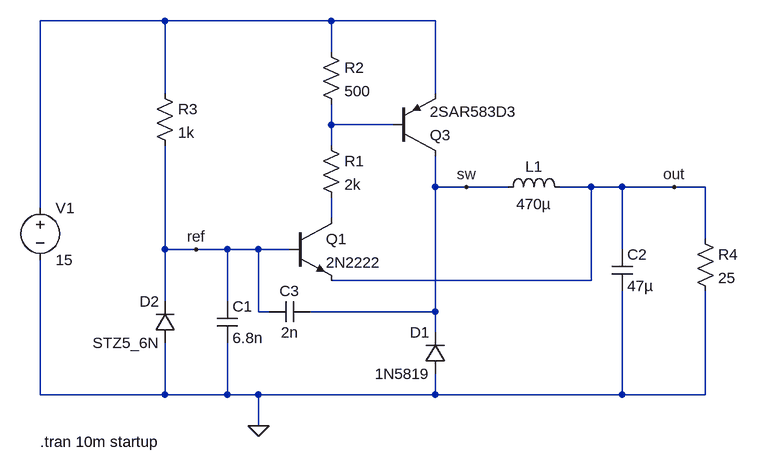
[diagram p0: schematic 2t_buck1.asc]
2t_buck1.asc, the LTspice schematic file:
Version 4.1
SHEET 1 880 680
WIRE -176 -240 -368 -240
WIRE 80 -240 -176 -240
WIRE 240 -240 80 -240
WIRE 80 -192 80 -240
WIRE -176 -128 -176 -240
WIRE 240 -128 240 -240
WIRE 80 -80 80 -112
WIRE 176 -80 80 -80
WIRE 80 -48 80 -80
WIRE 240 16 240 -32
WIRE 288 16 240 16
WIRE 352 16 288 16
WIRE 480 16 432 16
WIRE 528 16 480 16
WIRE 608 16 528 16
WIRE 656 16 608 16
WIRE -368 48 -368 -240
WIRE 80 64 80 32
WIRE 656 96 656 16
WIRE -176 112 -176 -48
WIRE -128 112 -176 112
WIRE -80 112 -128 112
WIRE -32 112 -80 112
WIRE 16 112 -32 112
WIRE 528 112 528 16
WIRE 480 160 480 16
WIRE 480 160 80 160
WIRE -176 192 -176 112
WIRE -80 192 -80 112
WIRE -32 208 -32 112
WIRE -16 208 -32 208
WIRE 240 208 240 16
WIRE 240 208 48 208
WIRE 240 240 240 208
WIRE -368 336 -368 128
WIRE -176 336 -176 256
WIRE -176 336 -368 336
WIRE -80 336 -80 256
WIRE -80 336 -176 336
WIRE -32 336 -80 336
WIRE 240 336 240 304
WIRE 240 336 -32 336
WIRE 528 336 528 176
WIRE 528 336 240 336
WIRE 656 336 656 176
WIRE 656 336 528 336
WIRE -32 384 -32 336
FLAG -32 384 0
FLAG 608 16 out
FLAG 288 16 sw
FLAG -128 112 ref
SYMBOL diode 256 304 R180
WINDOW 0 24 64 Left 2
WINDOW 3 24 0 Left 2
SYMATTR InstName D1
SYMATTR Value 1N5819
SYMATTR Description Diode
SYMATTR Type diode
SYMBOL npn 16 64 R0
SYMATTR InstName Q1
SYMATTR Value 2N2222
SYMBOL pnp 176 -32 M180
SYMATTR InstName Q3
SYMATTR Value 2SAR583D3
SYMBOL res 64 -64 R0
SYMATTR InstName R1
SYMATTR Value 2k
SYMBOL res 64 -208 R0
SYMATTR InstName R2
SYMATTR Value 500
SYMBOL res -192 -144 R0
SYMATTR InstName R3
SYMATTR Value 1k
SYMBOL cap -96 192 R0
SYMATTR InstName C1
SYMATTR Value 6.8n
SYMBOL cap 512 112 R0
SYMATTR InstName C2
SYMATTR Value 47µ
SYMBOL ind 336 32 R270
WINDOW 0 32 56 VTop 2
WINDOW 3 5 56 VBottom 2
SYMATTR InstName L1
SYMATTR Value 470µ
SYMATTR SpiceLine Rser=1m
SYMBOL res 640 80 R0
SYMATTR InstName R4
SYMATTR Value 25
SYMBOL voltage -368 32 R0
SYMATTR InstName V1
SYMATTR Value 15
SYMBOL diode -160 256 R180
WINDOW 0 24 64 Left 2
WINDOW 3 24 0 Left 2
SYMATTR InstName D2
SYMATTR Value STZ5_6N
SYMATTR Description Diode
SYMATTR Type diode
SYMBOL cap 48 192 R90
WINDOW 0 0 32 VBottom 2
WINDOW 3 32 32 VTop 2
SYMATTR InstName C3
SYMATTR Value 2n
TEXT -368 408 Left 2 !.tran 10m startup

The netlist it stands for:
* 2t_buck1.asc
D1 0 sw 1N5819
Q1 N003 ref out 0 2N2222
Q3 sw N002 N001 0 2SAR583D3
R1 N002 N003 2k
R2 N001 N002 500
R3 N001 ref 1k
C1 ref 0 6.8n
C2 out 0 47µ
L1 sw out 470µ Rser=1m
R4 out 0 25
V1 N001 0 15
D2 0 ref STZ5_6N
C3 sw ref 2n
.model D D
.lib standard.dio
.model NPN NPN
.model PNP PNP
.lib standard.bjt
.tran 10m startup
.backanno
.end